# Altium schematic sheet IDCI_WifiNode_PWR.SchDoc
size A4
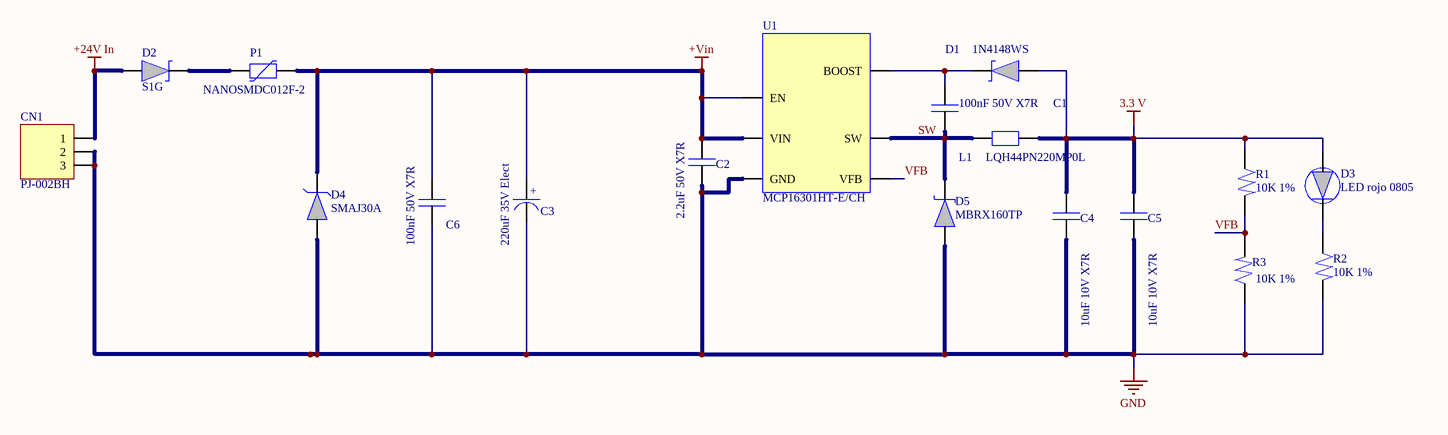
[diagram p0: IDCI_WifiNode_PWR.SchDoc]

## Parts
C1  100nF 50V X7R
C2  2.2uF 50V X7R
C3  220uF 35V Elect
C4  10uF 10V X7R
C5  10uF 10V X7R
C6  100nF 50V X7R
CN1  PJ-002BH
D1  1N4148WS
D2  S1G
D3  LED rojo 0805
D4  SMAJ30A
D5  MBRX160TP
L1  LQH44PN220MP0L
P1  NANOSMDC012F-2
R1  10K 1%
R2  10K 1%
R3  10K 1%
U1  MCP16301HT-E/CH

## Nets
3.3 V: C4.39 C5.39 D1.34 D3.31 L1.46 R1.47
+24V In: CN1.42(1) D2.34
+Vin: C2.39 C3.36 C6.39 D4.33 P1.40 U1.49(EN) U1.50(VIN)
GND: C2.38 C3.37 C4.38 C5.38 C6.38 CN1.43(2) CN1.44(3) D4.32 D5.34 R2.48 R3.47 U1.51(GND)
SW: C1.38 D5.35 L1.45 U1.52(SW)
VFB: R1.48 R3.48 U1.54(VFB)
NetC1_39: C1.39 D1.35 U1.53(BOOST)
NetD2_35: D2.35 P1.41
NetD3_30: D3.30 R2.47

## Notes on the sheet
- Title:
- Size:
- Author:
- A4
- Sheet
- of
- Revision:
- File:
- Date:
- (in symbol POL_CAP) +

## Library data of the parts
C1 C2 C4-C6 = CAPACITOR: Capacitor AF
C3 = POL_CAP: Capacitor polarizado
CN1 = Connector
D1 D2 D5 = TVS_DIODE
D3 = LED_DIODE
D4 = ZENER_DIODE
L1 = Inductor
P1 = Polyswitch
R1-R3 = Resistor
U1 = Integrado: Driver Switching